# EAGLE design DB (EAGLE 9.6.1)
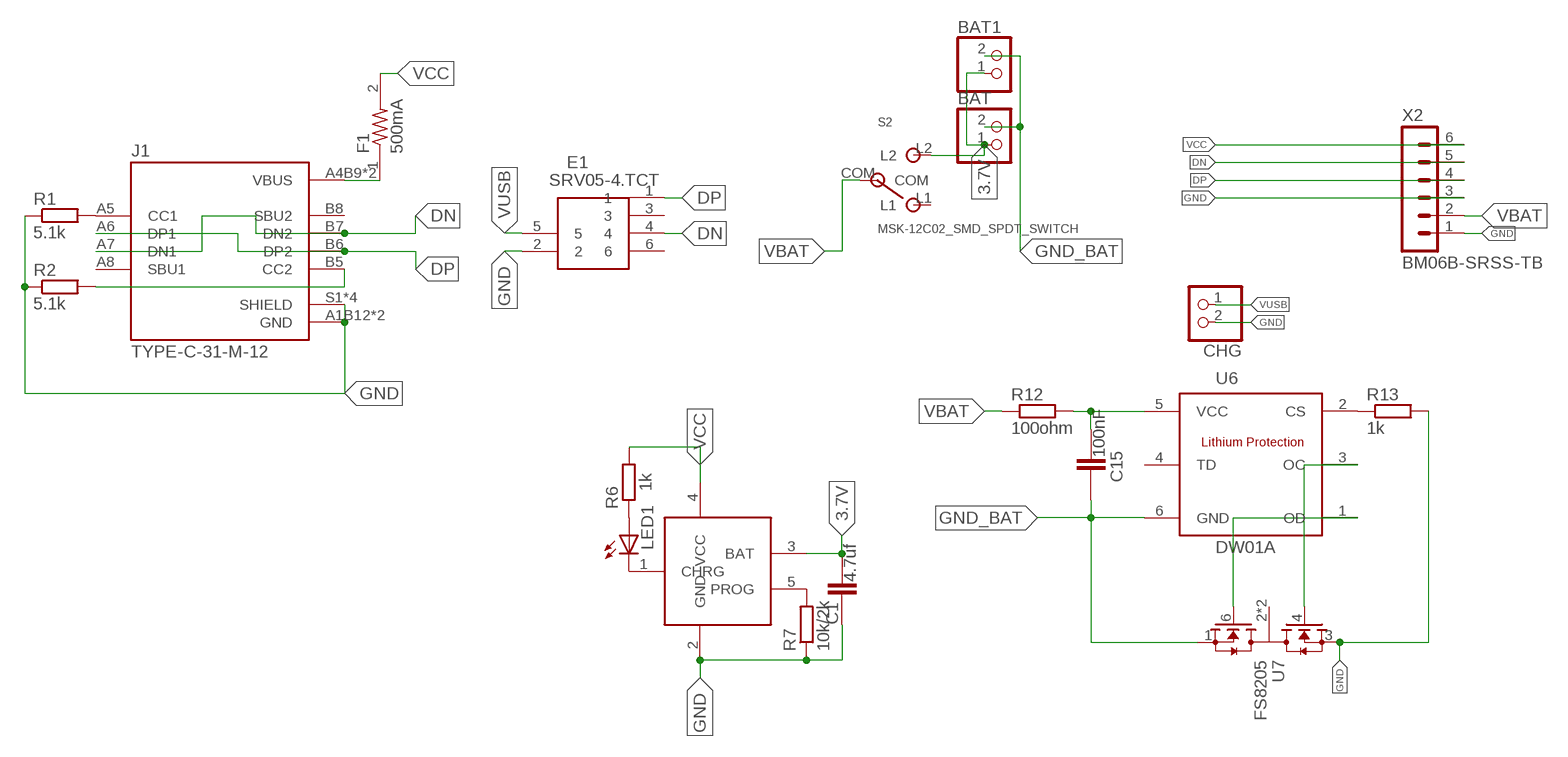
[diagram p0: schematic, sheet 1]

## Parts
BAT  JST_2PIN-THM-RA  [JST-PH-2-THM-RA]
BAT1  JST_2PIN-THM-RA  [JST-PH-2-THM-RA]
C1  4.7uf  CAPACITOR-C0805  [C0805]
C15  100nF  CAPACITOR-C0805  [C0805]
CHG  JST_2PIN-THM-RA  [JST-PH-2-THM-RA]
E1  SRV05-4.TCT  [SOT95P280X145-6N]
F1  500mA  0ZCJ0075AF2E  [RESC3216X125N]
J1  TYPE-C-31-M-12  [HRO_TYPE-C-31-M-12]
LED1  LEDCHIPLED_1206  [CHIPLED_1206]
R1  5.1k  RESISTOR-0805  [R0805]
R2  5.1k  RESISTOR-0805  [R0805]
R6  1k  RESISTOR-0805  [R0805]
R7  10k/2k  RESISTOR-0805  [R0805]
R12  100ohm  RESISTOR-0805  [R0805]
R13  1k  RESISTOR-0805  [R0805]
S2  MSK-12C02_SMD_SPDT_SWITCH  [MSK-12C02]
U3  LTC4054  [LTC4054]
U6  DW01A  [SOT23-6]
U7  FS8205  [SOT95P280X145-6N]
X2  BM06B-SRSS-TB  [BM06B-SRSS-TB]

## Nets
3.7V: BAT1.1 BAT.1 C1.2 S2.L2 U3.3(BAT)
DN: E1.4 J1.A7(DN1) J1.B7(DN2) X2.5
DP: E1.1 J1.A6(DP1) J1.B6(DP2) X2.4
GND: C1.1 CHG.2 E1.2 J1.A1B12(GND) J1.B1A12(GND) J1.S1(SHIELD) J1.S2(SHIELD) J1.S3(SHIELD) J1.S4(SHIELD) R1.1 R2.1 R7.1 R13.2 U3.2(GND) U7.3(S2) X2.1 X2.3
GND_BAT: BAT1.2 BAT.2 C15.1 U6.6(GND) U7.1(S1)
N$83: J1.A5(CC1) R1.2
N$85: J1.B5(CC2) R2.2
N$87: R7.2 U3.5(PROG)
N$88: LED1.C U3.1(CHRG)
N$89: LED1.A R6.1
N$110: C15.2 R12.2 U6.5(VCC)
N$111: R13.1 U6.2(CS)
N$112: U6.1(OD) U7.6(G1)
N$113: U6.3(OC) U7.4(G2)
VBAT: R12.1 S2.COM X2.2
VCC: F1.2 R6.2 U3.4(VCC) X2.6
VUSB: CHG.1 E1.5 F1.1 J1.A4B9(VBUS) J1.B4A9(VBUS)
Unconnected: E1.3 E1.6 J1.A8(SBU1) J1.B8(SBU2) S2.L1 U6.4(TD) U7.2(D12) U7.5(D12)

## Library data of the parts
BAT BAT1 CHG = adafruit:JST_2PIN: JST 2-Pin Connectors of various flavors SMT-RA (S2B-PH-SM4) 4UConnector #17311 SMT (B2B-PH-SM4) THM-RA (S2B-PH) THM (B2B-PH)
C1 C15 = Components:CAPACITOR
E1 = SRV05-4.TCT:SRV05-4.TCT: Semtech SRV05-4.TCT, Uni-Directional TVS Diode Array, 300W, 6-Pin SOT-23 Source: Datasheet <https://componentsearchengine.com/Datasheets/1/SRV05-4.TCT.pdf> Check prices <https://pricing.snapeda.com/parts/SRV05-4.TC/Semtech/view-part?ref=eda>; AVAILABILITY: In Stock; DESCRIPTION: 17.5V Clamp 12A (8/20µs) Ipp Tvs Diode Surface Mount SOT-23-6; MF: Semtech; MP: SRV05-4.TC; PACKAGE: SOT-23-6 Semtech; PRICE: None; PURCHASE-URL: https://pricing.snapeda.com/search/part/SRV05-4.TC/?ref=eda
F1 = fuse:0ZCJ0075AF2E: PTC RESTTBLE 0.75A 16V CHIP 1206 Check prices <https://pricing.snapeda.com/parts/0ZCJ0075AF2E/Bel%20Fuse/view-part?ref=eda>; AVAILABILITY: In Stock; DESCRIPTION: 1206 SMT PPTC | 0.75 Ih | 16V; MF: Bel Fuse; MP: 0ZCJ0075AF2E; PACKAGE: 1206 Bel Fuse; PRICE: None; PURCHASE-URL: https://pricing.snapeda.com/search/part/0ZCJ0075AF2E/?ref=eda
J1 = TYPE-C-31-M-12:TYPE-C-31-M-12: USB Connectors 24 Receptacle 1 8.94*7.3mm RoHS; AVAILABILITY: Unavailable; DESCRIPTION: USB Connectors 24 Receptacle 1 8.94*7.3mm RoHS; MF: HRO Electronics Co., Ltd.; MP: TYPE-C-31-M-12; PACKAGE: Package; PRICE: None
LED1 = adafruit:LED: LED OSRAM: - CHIPLED LG R971, LG N971, LY N971, LG Q971, LY Q971, LO R971, LY R971 LH N974, LH R974 LS Q976, LO Q976, LY Q976 LO Q996 - Hyper CHIPLED LW Q18S LB Q993, LB Q99A, LB R99A - SideLED LS A670, LO A670, LY A670, LG A670, LP A670 LB A673, LV A673, LT A673, LW A673 LH A674 LY A675 LS A676, LA A676, LO A676, LY A676, LW A676 LS A679, LY A679, LG A679 - Hyper Micro SIDELED® LS Y876, LA Y876, LO Y876, LY Y876 LT Y87S - SmartLED LW L88C, LW L88S LB L89C, LB L89S, LG L890 LS L89K, LO L89K, LY L89K LS L896, LA L896, LO L896, LY L896 - TOPLED LS T670, LO T670, LY T670, LG T670, LP T670 LSG T670, LSP T670, LSY T670, LOP T670, LYG T670 LG T671, LOG T671, LSG T671 LB T673, LV T673, LT T673, LW T673 LH T674 LS T676, LA T676, LO T676, LY T676, LB T676, LH T676, LSB T676, LW T676 LB T67C, LV T67C, LT T67C, LS T67K, LO T67K, LY T67K, LW E67C LS E67B, LA E67B, LO E67B, LY E67B, LB E67C, LV E67C, LT E67C LW T67C LS T679, LY T679, LG T679 LS T770, LO T770, LY T770, LG T770, LP T770 LB T773, LV T773, LT T773, LW T773 LH T774 LS E675, LA E675, LY E675, LS T675 LS T776, LA T776, LO T776, LY T776, LB T776 LHGB T686 LT T68C, LB T68C - Hyper Mini TOPLED® LB M676 - Mini TOPLED Santana® LG M470 LS M47K, LO M47K, LY M47K Source: http://www.osram.convergy.de/
R1 R2 R6 R7 R12 R13 = Components:RESISTOR
S2 = MSK-12C02 SMD Micro Slider Switch SPDT:MSK-12C02_SMD_SPDT_SWITCH: Footprint of the VIMEX MSK-12C02 SPDT SMD Switch Created by mzst on 17-Jan-2016
U3 = LTC4054:LTC4054: LTC4054 Li-ion Charger IC TSOT 5
U6 = DW01A:DW01A: Check availability <https://pricing.snapeda.com/parts/DW01A/Fortune%20Semiconductor/view-part?ref=eda>; AVAILABILITY: Not in stock; DESCRIPTION: One Cell Lithium-ion/Polymer Battery Protection IC; MF: Fortune Semiconductor; MP: DW01A; PACKAGE: SOT-23-6 Fortune Semiconductor; PRICE: None
U7 = FS8205:FS8205: Dual N Channel Enhancement Mode Power MOSFET Check availability <https://pricing.snapeda.com/parts/FS8205/Fortune%20Semiconductor/view-part?ref=eda>; AVAILABILITY: Not in stock; DESCRIPTION: Dual N-Channel Enhancement Mode Power MOSFET; MF: Fortune Semiconductor; MP: FS8205; PACKAGE: Package; PRICE: None
X2 = con-JST SH:BM06B-SRSS: JST SH series header 1.00mm pitch disconnectable crimp style connectors, vertical (side entry type), 6 pins

## Board
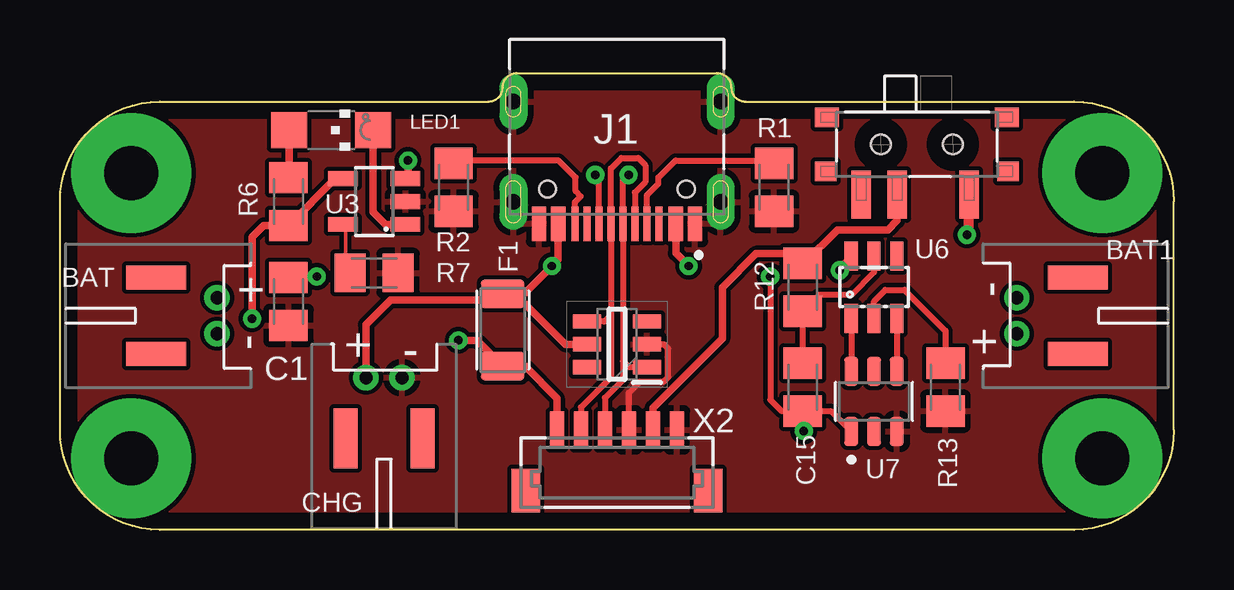
[diagram p1: board, top side]
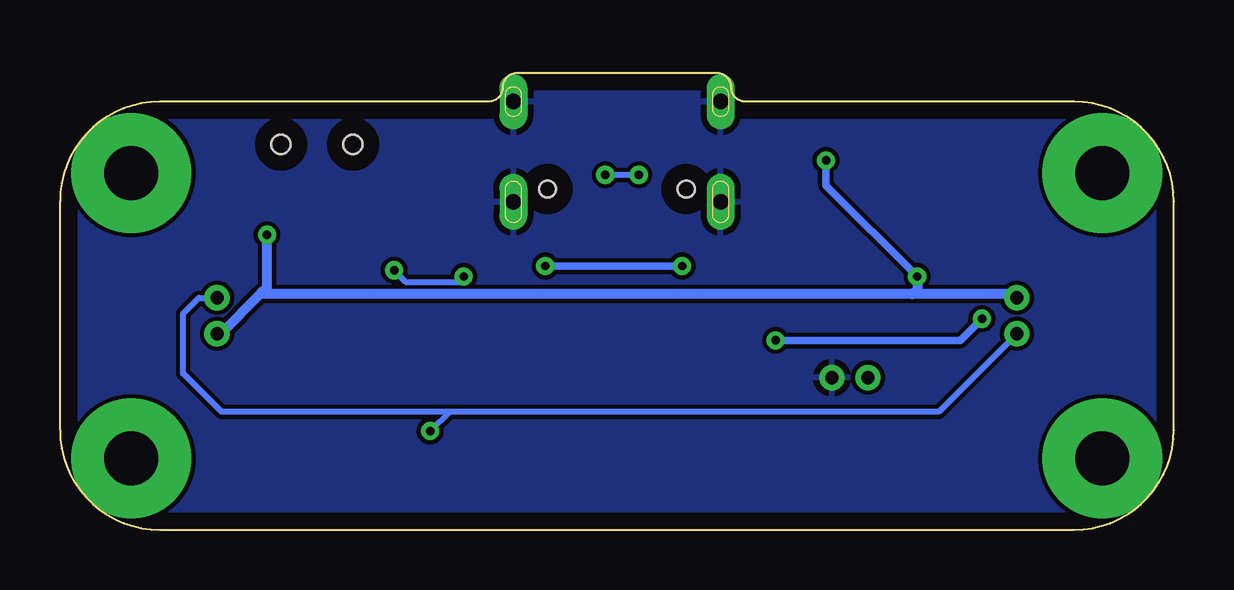
[diagram p2: board, bottom side, seen from below]

Size 46.43 x 19.05 mm. Coordinates in mm from the lower left corner, seen from the top.
Outline: 0,4.17 0,13.69 arc-90 4.17,17.86 17.86,17.86 arc90 18.45,18.45 arc-90 19.05,19.05 27.38,19.05 arc-90 27.98,18.45 arc90 28.57,17.86 42.27,17.86 arc-90 46.43,13.69 46.43,4.17 arc-90 42.27,0 4.17,0 arc-90 0,4.17
Copper layers (1*16): Top 0.035mm / dielectric 1.5mm / Bottom 0.035mm
Design rules "default *": minimum track width 6mil, minimum drill 0.35mm, track to track 7mil, track to pad 7mil, pad to pad 7mil, via to via 6mil, smd to smd 6mil, copper to edge 27mil, drill to drill 6mil, minimum pad ring 10mil, minimum via ring 8mil, stop-mask expansion 4mil, vias tented up to drill 14mil, thermal gap 10mil

### Footprints (pad centres in the part's own frame; a part is rotated, then mirrored left to right if it is on the bottom)
JST-PH-2-THM-RA = drill 0.55 pad 1.016: 1 0.75,0; 2 -0.75,0 | smd 1 x 2.5: P$1 -1.6,2.54; P$2 1.6,2.54
C0805 = smd 1.3 x 1.6: 1 -1,0; 2 1,0
SOT95P280X145-6N = smd 1.15 x 0.6: 1 -1.25,0.95; 2 -1.25,0; 3 -1.25,-0.95; 4 1.25,-0.95; 5 1.25,0; 6 1.25,0.95
RESC3216X125N = smd 1.2 x 1.82: 1 -1.505,0; 2 1.505,0
HRO_TYPE-C-31-M-12 = smd 0.6 x 1.45: A1B12 -3.25,5.095; A4B9 -2.45,5.095; B1A12 3.25,5.095; B4A9 2.45,5.095 | smd 0.3 x 1.45: A5 -1.25,5.095; A6 -0.25,5.095; A7 0.25,5.095; A8 1.25,5.095; B5 1.75,5.095; B6 0.75,5.095; B7 -0.75,5.095; B8 -1.75,5.095 | drill 0.65 pad 1.05 long: S1 -4.32,4.18; S2 4.32,4.18; S3 -4.32,0; S4 4.32,0 | hole 0.7: -2.89,3.65; 2.89,3.65
CHIPLED_1206 = smd 1.5 x 1.5: A 0,-1.75; C 0,1.75
R0805 = smd 1.3 x 1.6: 1 -1,0; 2 1,0
MSK-12C02 = smd 0.8 x 2: COM 0.823,2.1; L1 2.323,2.1; L2 -2.177,2.1 | smd 1 x 0.8: GND@1 -3.75,-1.125; GND@4 3.75,-1.125 | smd 0.9 x 0.8: GND@2 -3.8,1.125; GND@3 3.8,1.125 | hole 0.8: -1.5,0; 1.5,0
LTC4054 = smd 0.62 x 1.22: 1 -0.95,-1.3; 2 0,-1.3; 3 0.95,-1.3; 4 0.95,1.3; 5 -0.95,1.3
SOT23-6 = smd 0.55 x 1.2: 1 -0.95,-1.3; 2 0,-1.3; 3 0.95,-1.3; 4 0.95,1.3; 5 0,1.3; 6 -0.95,1.3
SOT95P280X145-6N' = smd 1.21 x 0.59: 1 -1.255,0.95; 2 -1.255,0; 3 -1.255,-0.95; 4 1.255,-0.95; 5 1.255,0; 6 1.255,0.95
BM06B-SRSS-TB = smd 0.6 x 1.55: 1 2.5,0; 2 1.5,0; 3 0.5,0; 4 -0.5,0; 5 -1.5,0; 6 -2.5,0 | smd 1.2 x 1.8: M1 3.8,-2.525; M2 -3.8,-2.525

### Placement (x,y rotation side)
BAT  6.55,8.93 90 top
BAT1  39.89,8.93 270 top
C1  9.53,9.53 90 top
C15  30.96,5.95 90 top
CHG  13.51,6.35 180 top
E1  23.22,7.74 180 top
F1  18.45,8.33 270 top
J1  23.22,17.86 180 top
LED1  11.31,16.67 270 top
R1  29.77,14.29 90 top
R2  16.4,14.29 90 top
R6  9.53,13.69 270 top
R7  13.1,10.72 180 top
R12  30.96,10.12 270 top
R13  36.91,5.95 270 top
S2  35.72,16.07 180 top
U3  13.1,13.69 90 top
U6  33.93,10.12 0 top
U7  FS8205  [SOT95P280X145-6N']  33.93,5.36 90 top
X2  23.22,4.17 0 top

### Tracks (layer width: path | path; a pad name or v marks a point on that pad's centre or on a via)
3.7V  (via drill 0.35)
  Top 0.305: 9.84,10.53 C1.2 9.56,10.56 v10.7,10.56 | v14.5,15.4 14.5,14.75 U3.3
  Top 0.406: v37.8,12.3 37.9,12.4 S2.L2
  Bottom 0.305: v10.7,10.56 14.5,14.36 v14.5,15.4
  Bottom 0.406: 10.9,9.83 38.09,9.83 | 38.09,9.83 37.8,10.11 v37.8,12.3 | BAT.1 6.7,9.83 10.9,9.83 | v10.7,10.56 10.7,10.03 10.9,9.83 | 38.09,9.83 39.74,8.18 BAT1.1
DN
  Top 0.254: 22.97,8.97 J1.A7 22.97,15.07 23.4,15.5 24.1,15.5 24.4,15.2 24.4,14.5 23.97,14.07 J1.B7 | E1.4 22.69,8.69 22.97,8.97 | 22.97,8.97 22.97,6.37 21.72,5.12 X2.5
DP  (via drill 0.35)
  Top 0.254: 23.47,7.04 J1.A6 23.47,14.57 v23.7,14.8 | E1.1 23.72,6.79 23.47,7.04 | J1.B6 22.47,14.65 v22.31,14.8 | 23.47,7.04 23.47,6.26 22.72,5.51 X2.4
  Bottom 0.254: v22.31,14.8 v23.7,14.8
GND
  Top 0.152: 36.9,4.7 R13.2
  Top 0.254: X2.3 23.72,5.72 24.18,6.18 25.17,6.18 25.35,6.36 25.35,7.56 25.17,7.74 E1.2
  pour Top: -0.6,23.22 47.03,23.22 47.03,-0.6 -0.6,-0.6
  pour Bottom: -1.19,24.41 47.62,24.41 47.62,-1.19 -1.19,-1.19
GND_BAT  (via drill 0.35)
  Top 0.254: C15.1 32,4.95 32.13,4.95 U7.1 | v31,4.12 30.96,4.17 C15.1 | U6.6 32.5,10.94 v32.5,10.82 | v29.6,10.56 29.6,5.42 30.07,4.95 C15.1
  Bottom 0.254: BAT.2 9.8,4.92 30.2,4.92 | BAT1.2 40.65,9.68 41.3,9.02 41.3,6.52 39.7,4.92 30.2,4.92 | 30.2,4.92 v31,4.12 | v32.5,10.82 32.02,10.34 29.6,10.34 v29.6,10.56
N$1  (via drill 2.25 pad 5)
  other vias: 2.98,14.88
N$2  (via drill 2.25 pad 5)
  other vias: 2.98,2.98
N$3  (via drill 2.25 pad 5)
  other vias: 43.46,2.98
N$4  (via drill 2.25 pad 5)
  other vias: 43.46,14.88
N$83
  Top 0.254: J1.A5 24.47,13.96 24.94,14.43 24.94,14.69 25.66,15.4 29.65,15.4 R1.2
N$85
  Top 0.254: J1.B5 21.47,13.67 21.7,13.9 21.49,14.12 21.49,14.69 20.78,15.4 16.52,15.4 R2.2
N$87
  Top 0.152: U3.5 11.9,12.7 11.9,11.2 R7.2
N$88
  Top 0.305: LED1.C 13.06,13.25 13.57,12.74 U3.1
N$89
  Top 0.305: LED1.A 9.56,14.73 R6.1
N$110
  Top 0.254: U6.5 33.93,10.73 33,9.8 31.64,9.8 R12.2 C15.2
N$111
  Top 0.254: U6.2 33.93,9.53 34.4,10 35.2,10 36.91,8.3 R13.1
N$112
  Top 0.254: U6.1 U7.6
N$113
  Top 0.254: U6.3 U7.4
VBAT
  Top 0.305: S2.COM 34.9,12.9 34.5,12.5 32.4,12.5 31.02,11.12 R12.1 30.56,11.52 29.02,11.52 27.6,10.1 27.6,7.97 24.72,5.09 X2.2
VCC  (via drill 0.35)
  Top 0.305: X2.6 20.72,5.49 19.38,6.83 F1.2 17.38,7.9 v16.6,7.9 | v8,8.8 8,12.2 8.49,12.69 R6.2 11.47,14.64 U3.4
  Bottom 0.305: v16.6,7.9 8.9,7.9 v8,8.8
VUSB  (via drill 0.35)
  Top 0.305: J1.B4A9 20.77,11.27 v20.5,11 19.34,9.84 F1.1 | J1.A4B9 25.67,11.54 v26.2,11 | F1.1 18.97,9.84 21.07,7.74 E1.5 | F1.1 18.2,9.59 13.78,9.59 12.76,8.56 CHG.1
  Bottom 0.305: v26.2,11 v20.5,11